# Altium schematic sheet Master.SchDoc
size A; SheetNumber: 1; SheetTotal: 4
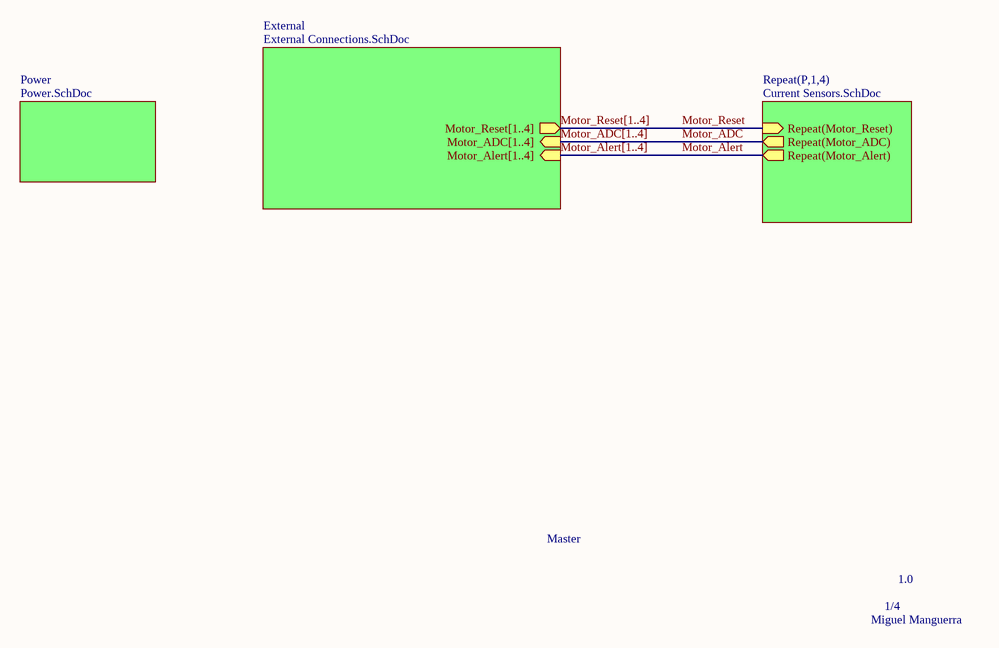
[diagram p0: Master.SchDoc]

## Sub-sheets
External = External Connections.SchDoc: Motor_Reset[1..4] (out), Motor_ADC[1..4] (in), Motor_Alert[1..4] (in)
Power = Power.SchDoc: no entries
Repeat(P,1,4) = Current Sensors.SchDoc: Repeat(Motor_Alert) (out), Repeat(Motor_Reset) (in), Repeat(Motor_ADC) (out)

## Nets
Motor_ADC: sheet Repeat(P,1,4)/Repeat(Motor_ADC)
Motor_Alert: sheet Repeat(P,1,4)/Repeat(Motor_Alert)
Motor_Reset: sheet Repeat(P,1,4)/Repeat(Motor_Reset)

## Buses and harness runs
bus Motor_ADC[1..4] = sheet External/Motor_ADC[1..4]
bus Motor_Alert[1..4] = sheet External/Motor_Alert[1..4]
bus Motor_Reset[1..4] = sheet External/Motor_Reset[1..4]

## Notes on the sheet
- Master
- 1/4
- 1.0
- Miguel Manguerra